# EAGLE design ptc (EAGLE 7.1.0)
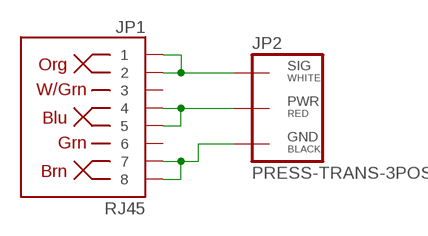
[diagram p0: schematic, sheet 1]

## Parts
JP1  RJ45  RJ45-8PTH  [RJ45-8]
JP2  PRESS-TRANS-3POS  [PRESSURE-TRANSDUCER-3POS]

## Nets
N$1: JP1.1 JP1.2 JP2.1
N$2: JP1.4 JP1.5 JP2.2
N$3: JP1.7 JP1.8 JP2.3
Unconnected: JP1.3 JP1.6

## Library data of the parts
JP1 = SparkFun-Connectors:RJ45-8: RJ45 Jack Simple RJ45, 8-pin connection - connector for common Cat5, Cat5e, and Cat6 Ethernet cables. Footprint not yet proven in production. Connector sku is PRT-00643; Breakout PCB sku is BOB-00716.; PROD_ID: CONN-08506
JP2 = SDSURocket-Connectors:PRESS-TRANS-3POS

## Board
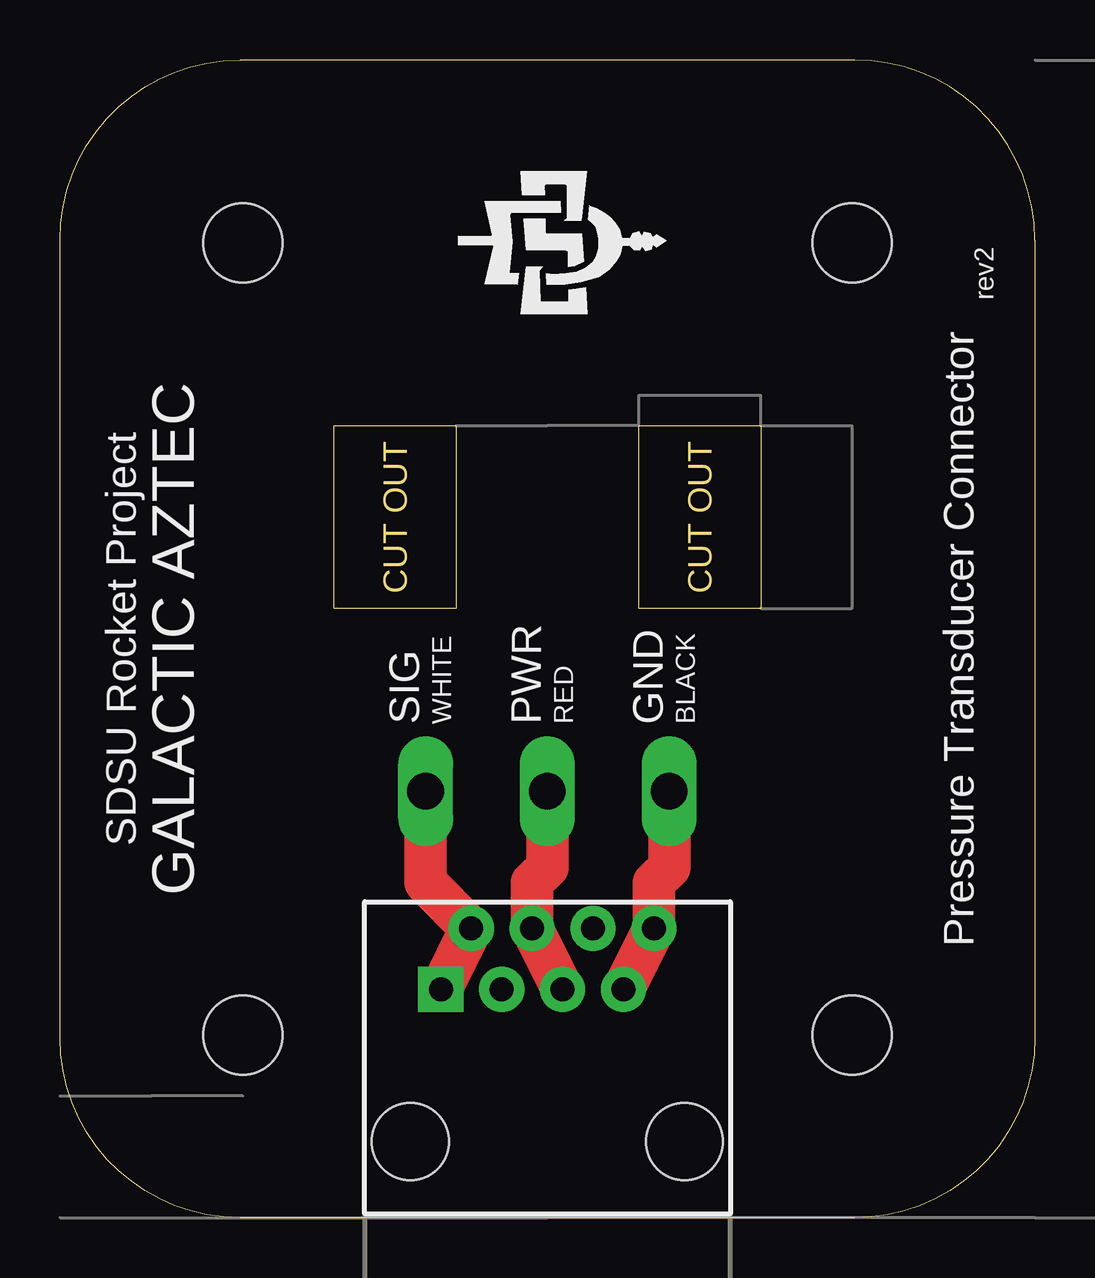
[diagram p1: board, top side]

Size 40.64 x 48.26 mm. Coordinates in mm from the lower left corner, seen from the top.
Outline: 33.14,0 7.5,0 arc-90 0,7.5 0,40.76 arc-90 7.5,48.26 33.14,48.26 arc-90 40.64,40.76 40.64,7.5 arc-90 33.14,0
Outline: 11.43,25.4 11.43,33.02 16.51,33.02 16.51,25.4 11.43,25.4
Outline: 24.13,25.4 24.13,33.02 29.21,33.02 29.21,25.4 24.13,25.4
Copper layers (1*16): Top 0.0356mm / dielectric 1.5011mm / Bottom 0.0356mm
Design rules "SparkFunBestPractices": minimum track width 10mil, minimum drill 13mil, track to track 10mil, track to pad 10mil, pad to pad 10mil, via to via 10mil, smd to smd 10mil, copper to edge 15mil, drill to drill 12mil, minimum pad ring 7mil, minimum via ring 7mil, stop-mask expansion 3mil, vias tented up to drill 0mil, thermal gap 10mil

### Footprints (pad centres in the part's own frame; a part is rotated, then mirrored left to right if it is on the bottom)
RJ45-8 = drill 1 pad 1.88 square: 1 -4.445,6.35 | drill 1 pad 1.88: 2 -3.175,8.89; 3 -1.905,6.35; 4 -0.635,8.89; 5 0.635,6.35; 6 1.905,8.89; 7 3.175,6.35; 8 4.445,8.89 | hole 3.2: -5.715,0; 5.715,0
PRESSURE-TRANSDUCER-3POS = drill 1.524 long: 1 -5.08,0; 2 0,0; 3 5.08,0
STAND-OFF = hole 3.302: 0,0

### Placement (x,y rotation side)
JP1  20.32,3.17 0 top
JP2  20.32,17.78 0 top
U$1  [STAND-OFF]  7.62,7.62 0 top
U$2  [STAND-OFF]  33.02,7.62 0 top
U$3  [STAND-OFF]  7.62,40.64 0 top
U$4  [STAND-OFF]  33.02,40.64 0 top

### Tracks (layer width: path | path; a pad name or v marks a point on that pad's centre or on a via)
N$1
  Top 1.778: JP2.1 15.24,13.97 JP1.2 JP1.1
N$2
  Top 1.778: JP1.5 JP1.4 19.68,13.97 20.32,14.61 JP2.2
N$3
  Top 1.778: JP1.7 JP1.8 24.77,13.97 25.4,14.61 JP2.3

### Text on the board
Dimension: CUT OUT | CUT OUT
tNames: rev2 | SDSU Rocket Project | GALACTIC AZTEC | Pressure Transducer Connector